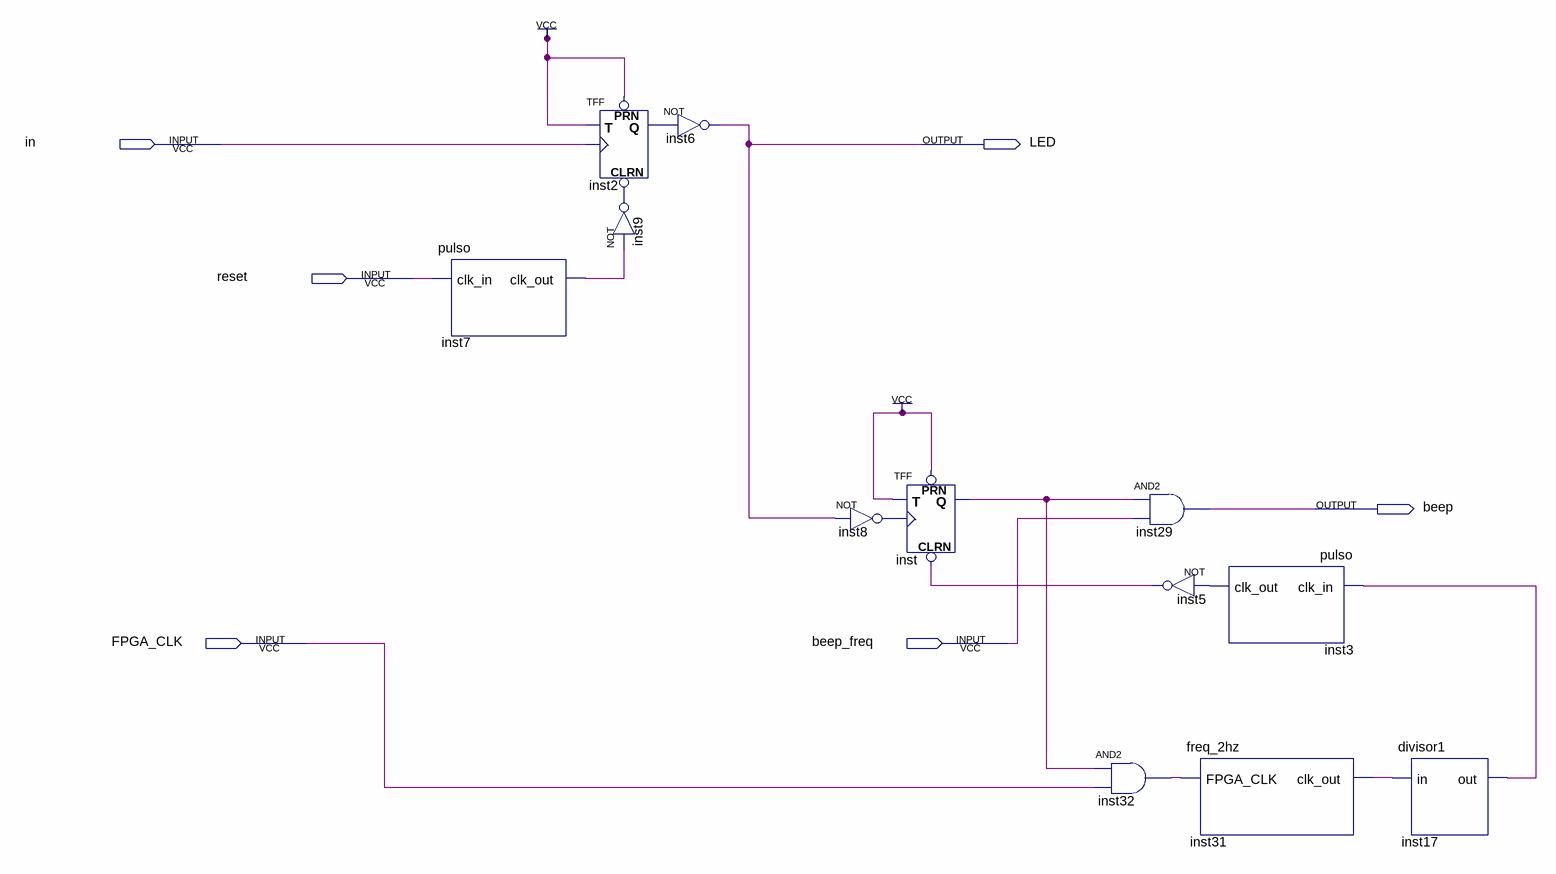
[diagram p0: schematic sheet]
// Quartus schematic chave_led_buzzer.bdf as structural Verilog: 12 symbols, 6 pins
module chave_led_buzzer (
  input  in,
  input  reset,
  input  FPGA_CLK,
  input  beep_freq,
  output LED,
  output beep
);

  wire inst2_q, inst3_clk_out, inst5_out, inst7_clk_out, inst8_out, inst9_out, inst17_out, inst31_clk_out,
       inst32_out, inst_q;

  pulso inst7 (.clk_in(reset), .clk_out(inst7_clk_out));
  TFF inst2 (.PRN(1'b1), .CLRN(inst9_out), .T(1'b1), .CLK(in), .Q(inst2_q));
  not inst9 (inst9_out, inst7_clk_out);
  not inst6 (LED, inst2_q);
  not inst8 (inst8_out, LED);
  TFF inst (.PRN(1'b1), .CLRN(inst5_out), .T(1'b1), .CLK(inst8_out), .Q(inst_q));
  and inst29 (beep, inst_q, beep_freq);
  not inst5 (inst5_out, inst3_clk_out);
  and inst32 (inst32_out, inst_q, FPGA_CLK);
  pulso inst3 (.clk_in(inst17_out), .clk_out(inst3_clk_out));
  freq_2hz inst31 (.FPGA_CLK(inst32_out), .clk_out(inst31_clk_out));
  divisor1 inst17 (.in(inst31_clk_out), .out(inst17_out));
endmodule
